# EAGLE design soic8 (EAGLE 7.7.0)
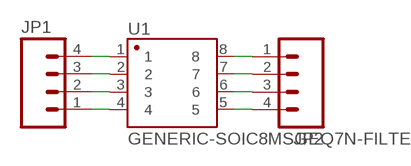
[diagram p0: schematic, sheet 1]

## Parts
JP1  M04NO_SILK_ALL_ROUND  [1X04_NO_SILK_ALL_ROUND]
JP2  M04NO_SILK_ALL_ROUND  [1X04_NO_SILK_ALL_ROUND]
U1  GENERIC-SOIC8MSGEQ7N-FILTER  [SO08]

## Nets
N$1: JP1.3 U1.2
N$2: JP1.1 U1.4
N$3: JP1.2 U1.3
N$4: JP2.1 U1.8
N$5: JP2.2 U1.7
N$6: JP2.3 U1.6
N$7: JP2.4 U1.5
N$9: JP1.4 U1.1

## Library data of the parts
JP1 JP2 = SparkFun-Connectors:M04: Header 4 Standard 4-pin 0.1" header. Use with straight break away headers (SKU : PRT-00116), right angle break away headers (PRT-00553), swiss pins (PRT-00743), machine pins (PRT-00117), and female headers (PRT-00115). Molex polarized connector foot print use with SKU : PRT-08231 with associated crimp pins and housings. 1MM SMD Version SKU: PRT-10208
U1 = SparkFun-AnalogIC:GENERIC-SOIC8: A placeholder for generic narrow & wide SOIC8 foorptints - used on the DIP adapter board.; PROD_ID: IC-10141

## Board
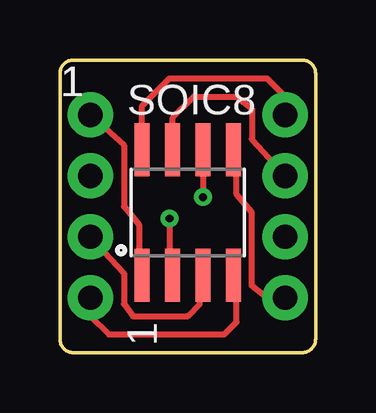
[diagram p1: board, top side]
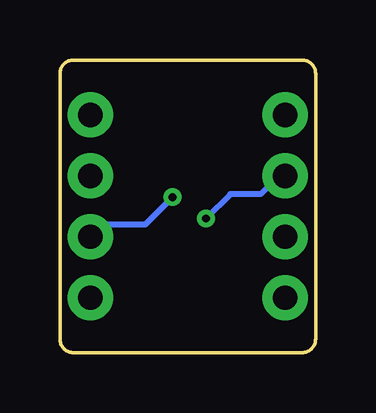
[diagram p2: board, bottom side, seen from below]

Size 10.67 x 12.19 mm. Coordinates in mm from the lower left corner, seen from the top.
Outline: 0,11.62 0,0.57 arc90 0.57,0 10.1,0 arc90 10.67,0.57 10.67,11.62 arc90 10.1,12.19 0.57,12.19 arc90 0,11.62
Copper layers (1*16): Top 0.035mm / dielectric 1.5mm / Bottom 0.035mm
Design rules "default *": minimum track width 10mil, minimum drill 24mil, track to track 8mil, track to pad 8mil, pad to pad 8mil, via to via 8mil, smd to smd 8mil, copper to edge 40mil, drill to drill 8mil, minimum pad ring 10mil, minimum via ring 8mil, stop-mask expansion 4mil, vias tented up to drill 13mil, thermal gap 10mil

### Footprints (pad centres in the part's own frame; a part is rotated, then mirrored left to right if it is on the bottom)
1X04_NO_SILK_ALL_ROUND = drill 1.016 pad 1.88: 1 0,0; 2 2.54,0; 3 5.08,0; 4 7.62,0
SO08 = smd 0.61 x 2.21: 1 -1.905,-2.616; 2 -0.635,-2.616; 3 0.635,-2.616; 4 1.905,-2.616; 5 1.905,2.616; 6 0.635,2.616; 7 -0.635,2.616; 8 -1.905,2.616

### Placement (x,y rotation side)
JP1  1.27,2.29 90 top
JP2  9.4,9.91 270 top
U1  5.33,5.84 0 top

### Tracks (layer width: path | path; a pad name or v marks a point on that pad's centre or on a via)
N$1  (via drill 0.33)
  Top 0.254: v4.57,5.59 4.57,3.35 U1.2
  Bottom 0.254: JP1.3 1.52,7.37 2.29,6.6 3.56,6.6 v4.57,5.59
N$2
  Top 0.254: JP1.1 1.27,1.52 2.03,0.76 6.86,0.76 7.37,1.27 7.37,3.1 U1.4
N$3
  Top 0.254: JP1.2 2.67,3.3 2.67,2.03 3.05,1.52 5.33,1.52 5.84,2.03 5.84,3.1 U1.3
N$4
  Top 0.254: U1.8 3.43,10.29 4.57,11.43 8.64,11.43 9.4,10.67 JP2.1
N$5
  Top 0.254: U1.7 4.7,9.78 5.59,10.67 7.37,10.67 8,10.16 8,8.89 JP2.2
N$6  (via drill 0.33)
  Top 0.254: U1.6 v5.97,6.48
  Bottom 0.254: v5.97,6.48 7.11,5.33 8.89,5.33 JP2.3
N$7
  Top 0.254: JP2.4 8.64,2.29 8,2.79 8,5.84 7.37,6.6 7.37,8.33 U1.5
N$9
  Top 0.254: JP1.4 2.67,8.64 2.67,6.1 3.3,5.33 3.3,3.35 U1.1

### Text on the board
tPlace: 1 | SOIC8 | 1